# Altium schematic sheet AMPLIFIER.SchDoc
size B; SheetNumber: 4; SheetTotal: 8
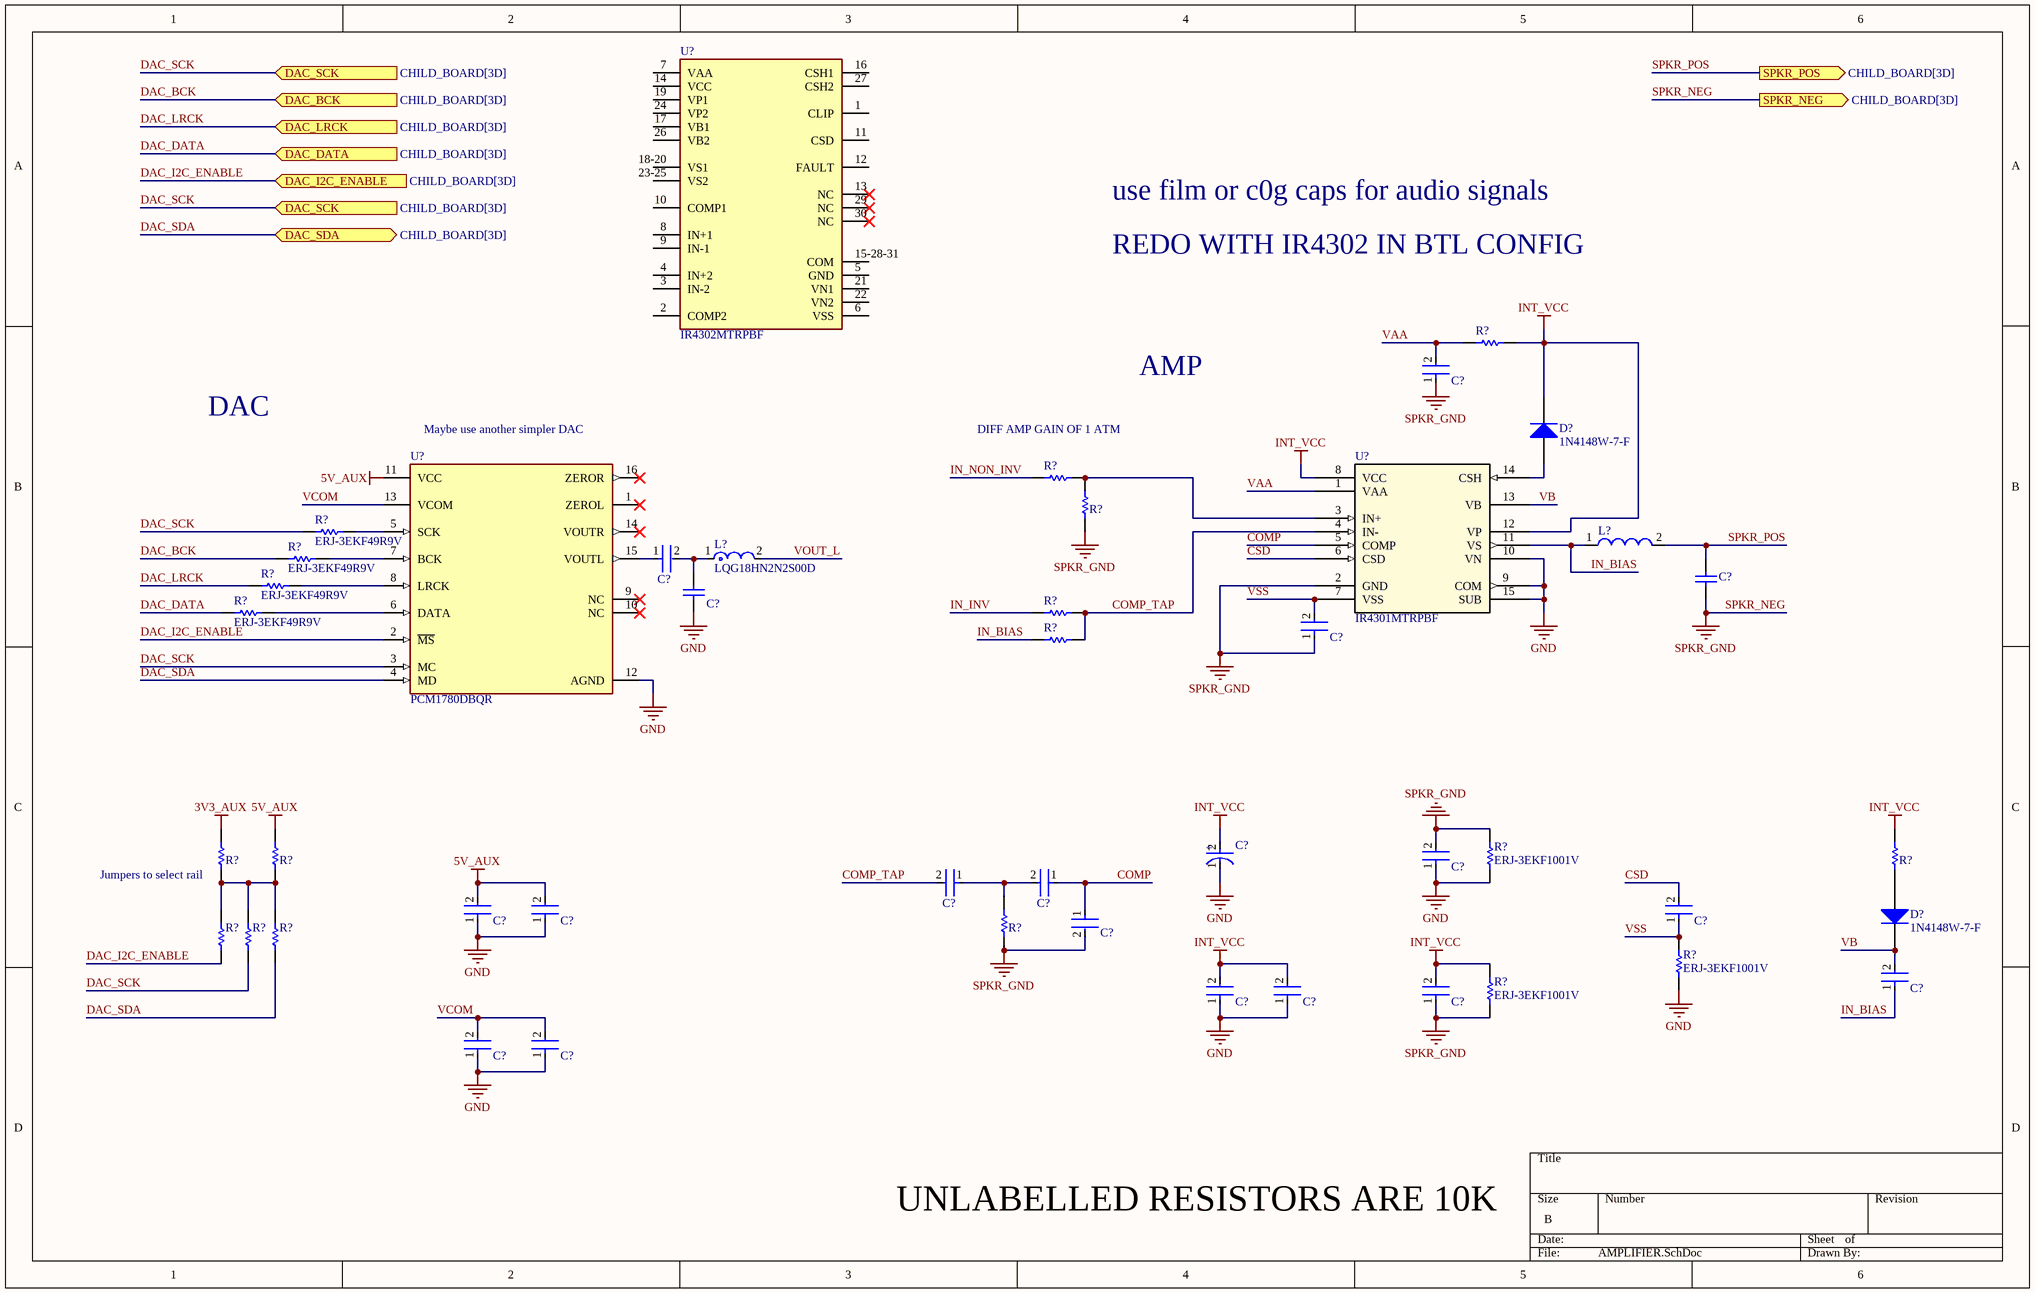
[diagram p0: AMPLIFIER.SchDoc]

## Parts
(Parts that share a designator on the sheet are numbered #1, #2 ... from top to bottom, then left to right.)
C?#1  C1005X7R1H104K050BB  [FP-C1005-050-0_05-IPC_C]  (value not drawn)
C?#2  GRM188R60J106ME47D  [FP-GRM188-0_1-e0_2_0_55-IPC_A]  (value not drawn)
C?#3  CAP 470nF 50V 1812(4532)  [CAPC1812(4532)230_N]  (value not drawn)
C?#4  0603 CAP  [CAPC1608X90X40ML10T20]  (value not drawn)
C?#5  C1005X7R1H104K050BB  [FP-C1005-050-0_05-IPC_C]  (value not drawn)
C?#6  EEV-FK1E222M  [FP-FKJ16-MFG]  (value not drawn)
C?#7  GRM188R60J106ME47D  [FP-GRM188-0_1-e0_2_0_55-IPC_A]  (value not drawn)
C?#8  C1005X7R1H104K050BB  [FP-C1005-050-0_05-IPC_C]  (value not drawn)
C?#9  C1005X7R1H104K050BB  [FP-C1005-050-0_05-IPC_C]  (value not drawn)
C?#10  C1005X7R1H104K050BB  [FP-C1005-050-0_05-IPC_C]  (value not drawn)
C?#11  GRM188R60J106ME47D  [FP-GRM188-0_1-e0_2_0_55-IPC_A]  (value not drawn)
C?#12  C1005X7R1H104K050BB  [FP-C1005-050-0_05-IPC_C]  (value not drawn)
C?#13  C1005X7R1H104K050BB  [FP-C1005-050-0_05-IPC_C]  (value not drawn)
C?#14  C1005X7R1H104K050BB  [FP-C1005-050-0_05-IPC_C]  (value not drawn)
C?#15  GRM188R60J106ME47D  [FP-GRM188-0_1-e0_2_0_55-IPC_A]  (value not drawn)
C?#16  C1005X7R1H104K050BB  [FP-C1005-050-0_05-IPC_C]  (value not drawn)
C?#17  GRM188R60J106ME47D  [FP-GRM188-0_1-e0_2_0_55-IPC_A]  (value not drawn)
C?#18  GRM188R60J106ME47D  [FP-GRM188-0_1-e0_2_0_55-IPC_A]  (value not drawn)
C?#19  C1005X7R1H104K050BB  [FP-C1005-050-0_05-IPC_C]  (value not drawn)
D?#1  1N4148W-7-F  [DIOD-SOD123-2_V]
D?#2  1N4148W-7-F  [DIOD-SOD123-2_V]
L?#1  74477110  [WE-PD-L]  (value not drawn)
L?#2  LQG18HN2N2S00D  [FP-LQG18HH_00-IPC_A]
R?#1  ERJ3EKF1002V  [RESC1609X55X30LL15T15]  (value not drawn)
R?#2  ERJ3EKF1002V  [RESC1609X55X30LL15T15]  (value not drawn)
R?#3  ERJ3EKF1002V  [RESC1609X55X30LL15T15]  (value not drawn)
R?#4  ERJ-3EKF49R9V  [RESC1608X55X30ML15T15]
R?#5  ERJ-3EKF49R9V  [RESC1608X55X30ML15T15]
R?#6  ERJ-3EKF49R9V  [RESC1608X55X30ML15T15]
R?#7  ERJ3EKF1002V  [RESC1609X55X30LL15T15]  (value not drawn)
R?#8  ERJ-3EKF49R9V  [RESC1608X55X30ML15T15]
R?#9  ERJ3EKF1002V  [RESC1609X55X30LL15T15]  (value not drawn)
R?#10  ERJ3EKF1002V  [RESC1609X55X30LL15T15]  (value not drawn)
R?#11  0402 JUMPER 0 OHM  [RESC1005X40X25NL05T05]  (value not drawn)
R?#12  0402 JUMPER 0 OHM  [RESC1005X40X25NL05T05]  (value not drawn)
R?#13  ERJ-3EKF1001V  [RESC1608X55X30LL15T15]
R?#14  ERJ3EKF1002V  [RESC1609X55X30LL15T15]  (value not drawn)
R?#15  ERJ3EKF1002V  [RESC1609X55X30LL15T15]  (value not drawn)
R?#16  ERJ3EKF1002V  [RESC1609X55X30LL15T15]  (value not drawn)
R?#17  ERJ3EKF1002V  [RESC1609X55X30LL15T15]  (value not drawn)
R?#18  ERJ-3EKF1001V  [RESC1608X55X30LL15T15]
R?#19  ERJ-3EKF1001V  [RESC1608X55X30LL15T15]
U?#1  IR4302MTRPBF  [FP-IR4302MTRPBF-MFG]
U?#2  PCM1780DBQR  [FP-DBQ0016A-IPC_C]
U?#3  IR4301MTRPBF  [IR4301MTRPBF-Footprint-1]

## Ports
DAC_BCK (in, see CHILD_BOARD[3D]), DAC_DATA (in, see CHILD_BOARD[3D]), DAC_I2C_ENABLE (in, see CHILD_BOARD[3D]), DAC_LRCK (in, see CHILD_BOARD[3D]), DAC_SCK (in, see CHILD_BOARD[3D]), DAC_SDA (bidir, see CHILD_BOARD[3D]), SPKR_NEG (out, see CHILD_BOARD[3D]), SPKR_POS (out, see CHILD_BOARD[3D])

## Nets
3V3_AUX: R?#11.2
5V_AUX: C?#11.2 C?#12.2 R?#12.2 U?#2.11(VCC)
GND: C?#4.1 C?#6.1(C) C?#7.1 C?#11.1 C?#12.1 C?#15.1 C?#16.1 C?#18.1 C?#19.1 R?#13.1 R?#18.1 U?#2.12(AGND) U?#3.9(COM) U?#3.10(VN) U?#3.15(SUB)
INT_VCC: C?#6.2(A) C?#15.2 C?#16.2 C?#17.2 D?#1.2(K) R?#1.2 R?#10.1 R?#19.2 U?#3.8(VCC) U?#3.12(VP)
SPKR_NEG: C?#1.1 C?#3.1 C?#5.1 C?#7.2 C?#10.2 C?#17.1 R?#3.1 R?#13.2 R?#14.1 R?#19.1 U?#3.2(GND) ; port SPKR_NEG  [also labelled SPKR_GND]
COMP: C?#9.1 C?#10.1 U?#3.5(COMP)
COMP_TAP: C?#8.2 R?#7.2 R?#9.2 U?#3.4(IN-)
CSD: C?#13.2 U?#3.6(CSD)
DAC_BCK: R?#5.2 ; port DAC_BCK
DAC_DATA: R?#8.2 ; port DAC_DATA
DAC_I2C_ENABLE: R?#15.1 U?#2.2(~{MS}) ; port DAC_I2C_ENABLE
DAC_LRCK: R?#6.2 ; port DAC_LRCK
DAC_SCK: R?#4.2 R?#16.1 U?#2.3(MC) ; port DAC_SCK
DAC_SDA: R?#17.1 U?#2.4(MD) ; port DAC_SDA
IN_BIAS: C?#14.1 L?#1.1 R?#9.1 U?#3.11(VS)
IN_INV: R?#7.1
IN_NON_INV: R?#2.1
SPKR_POS: C?#3.2 L?#1.2 ; port SPKR_POS
VAA: C?#1.2 R?#1.1 U?#3.1(VAA)
VB: C?#14.2 D?#2.2(K) U?#3.13(VB)
VCOM: C?#18.2 C?#19.2 U?#2.13(VCOM)
VOUT_L: L?#2.2
VSS: C?#5.2 C?#13.1 R?#18.2 U?#3.7(VSS)
NetC?#2_1: C?#2.1 U?#2.15(VOUTL)
NetC?#2_2: C?#2.2 C?#4.2 L?#2.1
NetC?#8_1: C?#8.1 C?#9.2 R?#14.2
NetD?#1_1: D?#1.1(A) U?#3.14(CSH)
NetD?#2_1: D?#2.1(A) R?#10.2
NetR?#2_2: R?#2.2 R?#3.2 U?#3.3(IN+)
NetR?#4_1: R?#4.1 U?#2.5(SCK)
NetR?#5_1: R?#5.1 U?#2.7(BCK)
NetR?#6_1: R?#6.1 U?#2.8(LRCK)
NetR?#8_1: R?#8.1 U?#2.6(DATA)
NetR?#11_1: R?#11.1 R?#12.1 R?#15.2 R?#16.2 R?#17.2

Not connected (* = marked no-connect by the designer): U?#1 1(CLIP) 2(COMP2) 3(IN-2) 4(IN+2) 5(GND) 6(VSS) 7(VAA) 8(IN+1) 9(IN-1) 10(COMP1) 11(CSD) 12(FAULT) 13(NC)* 14(VCC) 15-28-31(COM) 16(CSH1) 17(VB1) 18-20(VS1) 19(VP1) 21(VN1) 22(VN2) 23-25(VS2) 24(VP2) 26(VB2) 27(CSH2) 29(NC)* 30(NC)*; U?#2 1(ZEROL)* 9(NC)* 10(NC)* 14(VOUTR)* 16(ZEROR)*

## Notes on the sheet
- use film or c0g caps for audio signals
- REDO WITH IR4302 IN BTL CONFIG
- DAC
- (near U?#2) Maybe use another simpler DAC
- (near R?#2) DIFF AMP GAIN OF 1 ATM
- AMP
- (near R?#11) Jumpers to select rail
- UNLABELLED RESISTORS ARE 10K
- (in symbol CMP-00287-39480675-1) +

## Library data of the parts
C?#1 C?#5 C?#8-C?#10 C?#12-C?#14 C?#16 C?#19 = CMP-2000-05393-2: Multilayer Ceramic Capacitors 100nF ±10% 50V X7R SMD 0402; Voltage: 50V; Dielectric Material: Ceramic; Min Operating Temperature: -55°C; Depth: 0.5mm; Radiation Hardening: No; RoHS Compliant: Yes; Voltage Rating (DC): 50V; Lead Free: Lead Free; Resistor Type: Ceramic; Height: 0.5mm; Dielectric: X7R; Thickness: 0.022inch; Case/Package: 0402; Case Code (Metric): 1005; Termination: SMD/SMT; Capacitance: 100nF; Packaging: Tape and Reel; Max Operating Temperature: 125°C; Mount: Surface Mount; Package Quantity: 1; Width: 0.02inch; Weight: 2.3E-05oz; Voltage Rating: 50V; Tolerance: 10%; Construction: Flat; Case Code (Imperial): 0402; Length: 1mm; REACH SVHC: No SVHC; Series: C
C?#2 C?#7 C?#11 C?#15 C?#17 C?#18 = CMP-2006-02792-2: Chip Multilayer Ceramic Capacitors for General Purpose, 0603, 10uF, X5R, 15%, 20%, 6.3V; Packaging: Tape and Reel; Voltage Rating (DC): 6.3V; Width: 0.031inch; Termination: SMD/SMT; Dielectric: X5R; Package Quantity: 4000; Voltage Rating: 6.3V; Capacitance: 10uF; Case/Package: 0603; Min Operating Temperature: -55°C; Voltage: 6.3V; Length: 1.6mm; Thickness: 0.035inch; Lead Free: Lead Free; Depth: 0.8mm; Case Code (Imperial): 0603; Max Operating Temperature: 85°C; Material: Ceramic; Height: 0.8mm; Tolerance: 20%; Mount: Surface Mount; REACH SVHC: No SVHC; Radiation Hardening: No; Case Code (Metric): 1608
C?#3 = CMP-1040-01541-1: CAP 470nF 50V ±10% 1812 (4532 Metric) Thickness 2.3mm SMD; Case-Metric: 4532; Tolerance: Â±10%; Case-EIA: 1812; Value: 470nF; Technology: SMT; Max Thickness: 2.3 mm; Rated Voltage: 50 V
C?#4 = CMP-001-00087-1: 0pF 0603 capacitor placeholder
C?#6 = CMP-00287-39480675-1: EEV-FK1E222M Aluminum Electrolytic Capacitor, Polarized, Aluminum (wet), 35V, 20% +Tol, 20% -Tol, 100uF; Voltage: 25V; Leakage Current: 3µA; ESR (Equivalent Series Resistance): 35mΩ; Capacitance: 2.2mF; Ripple Current (AC): 1.8A; Life (Hours): 2000hours; Case/Package: Radial; Max Operating Temperature: 105°C; Packaging: Cut Tape; Height: 16.5mm; Radiation Hardening: No; Lifecycle Status: Production; Contact Plating: Tin; Tolerance: 20%; REACH SVHC: No SVHC; NexarPartId: 39480675; Voltage Rating (DC): 25V; Diameter: 16mm; Width: 1.2mm; Mount: PCB, Surface Mount; Length: 17mm; Termination: SMD/SMT; Lead Free: Lead Free; Height - Seated (Max): 16.51mm; Ripple Current: 1.8A; Schedule B: 8532220020, 8532220020; Voltage Rating: 25V; Impedance: 35mΩ; RoHS: Compliant; Min Operating Temperature: -55°C
D?#1 D?#2 = CMP-2000-04932-2: Fast Switching Diode, 100 V, 0.15 A, -65 to 150 degC, 2-Pin?SOD123, RoHS, Tape and Reel; Recovery Time: 4ns; Brand: DiodesIncorporated; Unit Weight: 0.000353oz; Max Surge Current: 2A; Peak Reverse Voltage: 100V; Ir - Reverse Current: 1uA; Vf - Forward Voltage: 1.25V; Configuration: Single; If - Forward Current: 0.15A; Product Category: Diodes-GeneralPurpose,Power,Switching; Operating Temperature Range: -65Cto+150C; Packaging: Reel; Manufacturer URL: http://www.diodes.com/; Maximum Operating Temperature: +150C; Height: 1.25mm; Minimum Operating Temperature: -65C; Product: SwitchingDiodes; Package URL: http://www.diodes.com/datasheets/ds18004.pdf; Type: SwitchingDiode; Package Reference: SOD123-2; Width: 1.7mm; Datasheet URL: http://www.farnell.com/datasheets/1915529.pdf; Datasheet Version: Rev. 24-2, 10/2013; Series: 1N4148; Factory Pack Quantity: 3000; Length: 2.85mm; RoHS: True; Manufacturer: DiodesIncorporated; Mounting Style: SMD/SMT; Package / Case: SOD-123
L?#1 = CMP-0227-00708-1: SMD-Shielded Power Inductor WE-PD, L = 10.0 µH; Inductance: 10.0 ÂµH; ComponentLink2Description: Datasheet; DatasheetVersion: ver 7, Sep-2006; PackageVersion: 2006; ComponentLink1URL: http://www.we-online.com; ComponentLink1Description: Manufacturer Link; ComponentLink2URL: http://www.we-online.de/katalog/media/pdf/74477110.pdf; PackageDescription: SMD Inductor, 2-Leads, Body 12.0 x 12.0 mm; PackageReference: WE-PD-L
L?#2 = CMP-06042-006288-1: Multilayer type RF Inductor 2.2nH ±0.3nH 0.1Ω 1100mA 0603; Max DC Current: 500mA; Core Material: Air; Self Resonant Frequency: 6GHz; Q Factor: 12; DC Resistance (DCR): 100mR; Shielding: Unshielded; Test Frequency: 100MHz; Inductance: 2.2nH; Depth: 0.95mm; Current Rating: 500mA; Packaging: Tape and Reel; Case/Package: 0603; Height - Seated (Max): 0.037inch; Mount: Surface Mount; Radiation Hardening: No; Max Operating Temperature: 85°C; Length: 0.063inch; Termination: SMD/SMT; Lead Free: Lead Free; Min Operating Temperature: -40°C; Number of Pins: 2; Case Code (Metric): 1608; Height: 0.8mm; REACH SVHC: No SVHC; Package Quantity: 4000; DC Current: 500mA; Width: 0.031inch; Military Standard: Not; Case Code (Imperial): 0603
R?#1-R?#3 R?#7 R?#9 R?#10 R?#14-R?#17 = CMP-1012-00623-3: Chip Resistor, 10 KOhm, +/- 1%, 0.1 W, -55 to 155 degC, 0603 (1608 Metric), RoHS, Tape and Reel; Manufacturer: Panasonic; Voltage Rating: 75V; Case\/Package: 0603; Power Rating: 100mW; Resistance: 10KOhm; Temperature Coefficient: 100ppm\/degreesC; Number of Pins: 2; Package Reference: 603; Depth: 0.8mm; Mount: SurfaceMount; Package Description: 2-Pin Surface Mount Device, Body 1.6 x 0.85 mm; Datasheet Version: 02/2017; Length: 1.6mm; Lead Free: LeadFree; Height: 0.45mm; Number of Terminations: 2; Max Power Dissipation: 100mW; Min Operating Temperature: -55degC; Datasheet URL: https://industrial.panasonic.com/cdbs/www-data/pdf/RDA0000/AOA0000C304.pdf; Termination: SMD/SMT; Case Code (Metric): 1608; Case Code (Imperial): 0603; Tolerance: 1%; Max Operating Temperature: 155degC; RoHSCompliant: true; Voltage Rating (DC): 75V; Radiation Hardening: No; Packaging: TapeandReel; Composition: ThickFilm; Mounting Technology: SurfaceMount; Manufacturer URL: http://www.panasonic.com/; Width: 0.031inch; REACH SVHC: NoSVHC; Contact Plating: Tin; Military Standard: Not; Package Quantity: 1
R?#4-R?#6 R?#8 = CMP-2000-00538-1: Manufacturer: Panasonic; Part Number: ERJ-3EKF49R9V
R?#11 R?#12 = CMP-009-00206-2: READ THE NAME
R?#13 R?#18 R?#19 = CMP-2000-00180-1: Manufacturer: Panasonic; Part Number: ERJ-3EKF1001V
U?#1 = CMP-32833-000008-1: IC AMP CLASS D STEREO 130W 44QFN; Operating Supply Voltage: 80V; Max Power Dissipation: 25W; Gain Bandwidth Product: 9MHz; Number of Channels: 2; Max Supply Voltage: 15V; Output Power: 70W; Number of Pins: 44; Lead Free: Lead Free; RoHS Compliant: Yes; Series: -; Packaging: Cut Tape; Max Operating Temperature: 100°C; Package Quantity: 1; Halogen Free: Halogen Free; Mount: Surface Mount; Min Operating Temperature: -40°C; Max Output Power: 130W; Contact Plating: Tin
U?#2 = CMP-04861-000034-1: IC DAC/AUDIO 24BIT 200K 16SSOP; Number of Channels: 2; Operating Supply Voltage: 5V; Conversion Rate: 192KS/s; Number of Analog Inputs: 0; Number of Bits: 24; Max Supply Voltage: 5.5V; Min Supply Voltage: 4.5V; Signal to Noise Ratio (SNR): 106dB; Max Power Dissipation: 200mW; Resolution: 24b; Interface: Serial; Output Type: Voltage; Sampling Rate: 200000S/s; Supply Type: Single; Power Consumption: 80mW; Nominal Supply Current: 30mA; Radiation Hardening: No; Number of Pins: 16; Packaging: Tape and Reel; Lead Free: Lead Free; Min Operating Temperature: -25°C; Number of Analog Outputs: 2; Weight: 0.002469oz; Package Quantity: 2000; Series: -; Number of Converters: 2; Case/Package: SSOP; Number of DAC Channels: 2; RoHS Compliant: Yes; Max Operating Temperature: 85°C; Mount: Surface Mount
U?#3 = CMP-014-00006-1: IR4301 Series 15 V Integrated Analog Input Class D Audio Amplifier - PQFN-22